# Altium schematic sheet Multi2Meter.SchDoc
size A4
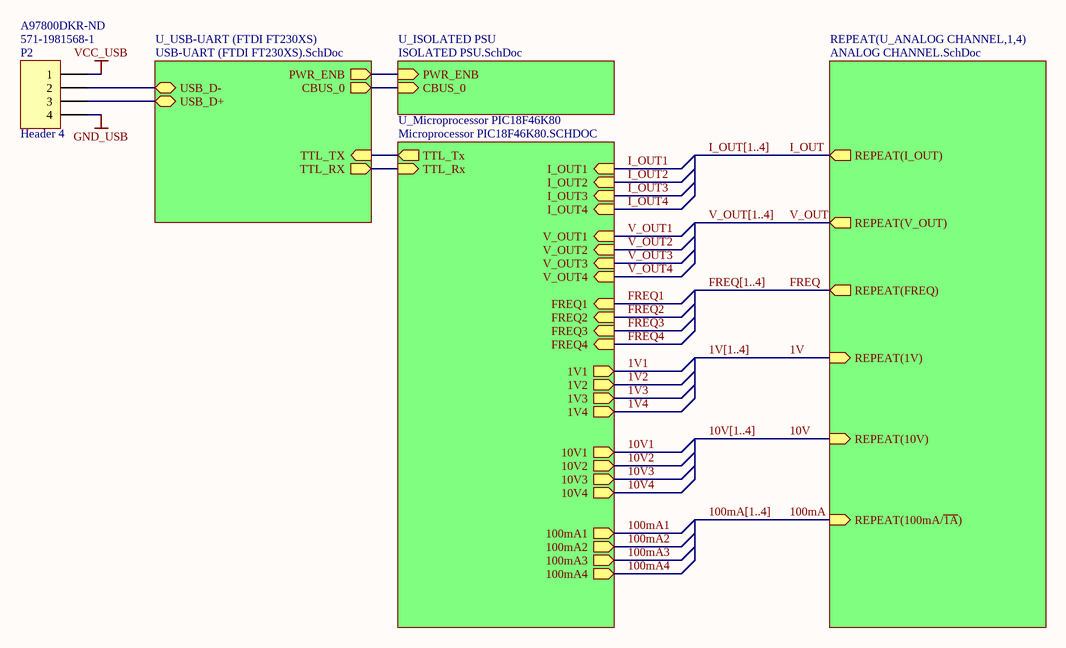
[diagram p0: Multi2Meter.SchDoc]

## Parts
P2  Header 4  Supplier Part Number 1: 571-1981568-1  Supplier Part Number 2: A97800DKR-ND  [MICRO USB]

## Sub-sheets
REPEAT(U_ANALOG CHANNEL,1,4) = ANALOG CHANNEL.SchDoc: REPEAT(FREQ) (out), REPEAT(1V) (in), REPEAT(10V) (in), REPEAT(100mA/~{1A}) (in), REPEAT(I_OUT) (out), REPEAT(V_OUT) (out)
U_ISOLATED PSU = ISOLATED PSU.SchDoc: PWR_ENB (in), CBUS_0 (in)
U_Microprocessor PIC18F46K80 = Microprocessor PIC18F46K80.SCHDOC: TTL_Rx (in), TTL_Tx (out), I_OUT1 (in), I_OUT2 (in), I_OUT3 (in), I_OUT4 (in), V_OUT1 (in), V_OUT2 (in), V_OUT3 (in), V_OUT4 (in), FREQ1 (in), FREQ2 (in), FREQ3 (in), FREQ4 (in), 1V1 (out), 1V2 (out), 1V3 (out), 1V4 (out), 10V1 (out), 10V2 (out), 10V3 (out), 10V4 (out), 100mA1 (out), 100mA2 (out), 100mA3 (out), 100mA4 (out)
U_USB-UART (FTDI FT230XS) = USB-UART (FTDI FT230XS).SchDoc: TTL_TX (in), TTL_RX (out), PWR_ENB (out), CBUS_0 (out), USB_D- (bidir), USB_D+ (bidir)

## Nets
GND_USB: P2.4
VCC_USB: P2.1
1V: sheet REPEAT(U_ANALOG CHANNEL,1,4)/REPEAT(1V)
1V1: sheet U_Microprocessor PIC18F46K80/1V1
1V2: sheet U_Microprocessor PIC18F46K80/1V2
1V3: sheet U_Microprocessor PIC18F46K80/1V3
1V4: sheet U_Microprocessor PIC18F46K80/1V4
10V: sheet REPEAT(U_ANALOG CHANNEL,1,4)/REPEAT(10V)
10V1: sheet U_Microprocessor PIC18F46K80/10V1
10V2: sheet U_Microprocessor PIC18F46K80/10V2
10V3: sheet U_Microprocessor PIC18F46K80/10V3
10V4: sheet U_Microprocessor PIC18F46K80/10V4
100mA: sheet REPEAT(U_ANALOG CHANNEL,1,4)/REPEAT(100mA/~{1A})
100mA1: sheet U_Microprocessor PIC18F46K80/100mA1
100mA2: sheet U_Microprocessor PIC18F46K80/100mA2
100mA3: sheet U_Microprocessor PIC18F46K80/100mA3
100mA4: sheet U_Microprocessor PIC18F46K80/100mA4
FREQ: sheet REPEAT(U_ANALOG CHANNEL,1,4)/REPEAT(FREQ)
FREQ1: sheet U_Microprocessor PIC18F46K80/FREQ1
FREQ2: sheet U_Microprocessor PIC18F46K80/FREQ2
FREQ3: sheet U_Microprocessor PIC18F46K80/FREQ3
FREQ4: sheet U_Microprocessor PIC18F46K80/FREQ4
I_OUT: sheet REPEAT(U_ANALOG CHANNEL,1,4)/REPEAT(I_OUT)
I_OUT1: sheet U_Microprocessor PIC18F46K80/I_OUT1
I_OUT2: sheet U_Microprocessor PIC18F46K80/I_OUT2
I_OUT3: sheet U_Microprocessor PIC18F46K80/I_OUT3
I_OUT4: sheet U_Microprocessor PIC18F46K80/I_OUT4
V_OUT: sheet REPEAT(U_ANALOG CHANNEL,1,4)/REPEAT(V_OUT)
V_OUT1: sheet U_Microprocessor PIC18F46K80/V_OUT1
V_OUT2: sheet U_Microprocessor PIC18F46K80/V_OUT2
V_OUT3: sheet U_Microprocessor PIC18F46K80/V_OUT3
V_OUT4: sheet U_Microprocessor PIC18F46K80/V_OUT4
NetP2_2: P2.2 ; sheet U_USB-UART (FTDI FT230XS)/USB_D-
NetP2_3: P2.3 ; sheet U_USB-UART (FTDI FT230XS)/USB_D+
(unnamed): sheet U_ISOLATED PSU/PWR_ENB, sheet U_USB-UART (FTDI FT230XS)/PWR_ENB
(unnamed): sheet U_ISOLATED PSU/CBUS_0, sheet U_USB-UART (FTDI FT230XS)/CBUS_0
(unnamed): sheet U_USB-UART (FTDI FT230XS)/TTL_TX, sheet U_Microprocessor PIC18F46K80/TTL_Tx
(unnamed): sheet U_USB-UART (FTDI FT230XS)/TTL_RX, sheet U_Microprocessor PIC18F46K80/TTL_Rx

## Buses and harness runs
bus 1V[1..4]
bus 10V[1..4]
bus 100mA[1..4]
bus FREQ[1..4]
bus I_OUT[1..4]
bus V_OUT[1..4]

## Library data of the parts
P2 = Header 4: Header, 4-Pin; LatestRevisionDate: 17-Jul-2002; LatestRevisionNote: Re-released for DXP Platform.; Publisher: Altium Limited; Supplier 1: Mouser; Supplier 2: Digi-Key